# Altium schematic sheet Overview.SchDoc
size 431 x 279 mm; Date: Not shown in title block; ApprovedBy: Not shown in title block; CheckedBy: Not shown in title block; Author: Not shown in title block; CompanyName: Not shown in title block; Engineer: Not shown in title block; Organization: Not shown in title block; Address1: Not shown in title block; Address2: Not shown in title block; Address3: Not shown in title block; Address4: Not shown in title block; DocumentNumber: 1; Revision: Use project parameter SCH_Rev; SheetNumber: 2; SheetTotal: 3; PageSetup: Record=PageOptions|CenterHorizontal=True|CenterVertical=True|PrintScale=1.00|XCorrection=1.00|YCorrection=1.00|PrintKind=0|BorderSize=5000000|LeftOffset=0|BottomOffset=0|Orientation=2|PaperLength=1000|PaperWidth=1000|Scale=100|PaperSource=15|PrintQuality=600|MediaType=1|DitherType=10|PaperKind=Letter|PrintScaleMode=1; CurrentTime: Not shown in title block; CurrentDate: Not shown in title block; Time: Not shown in title block; DocumentFullPathAndName: Not shown in title block; DocumentName: Not shown in title block; ModifiedDate: Not shown in title block; ImagePath: Not shown in title block
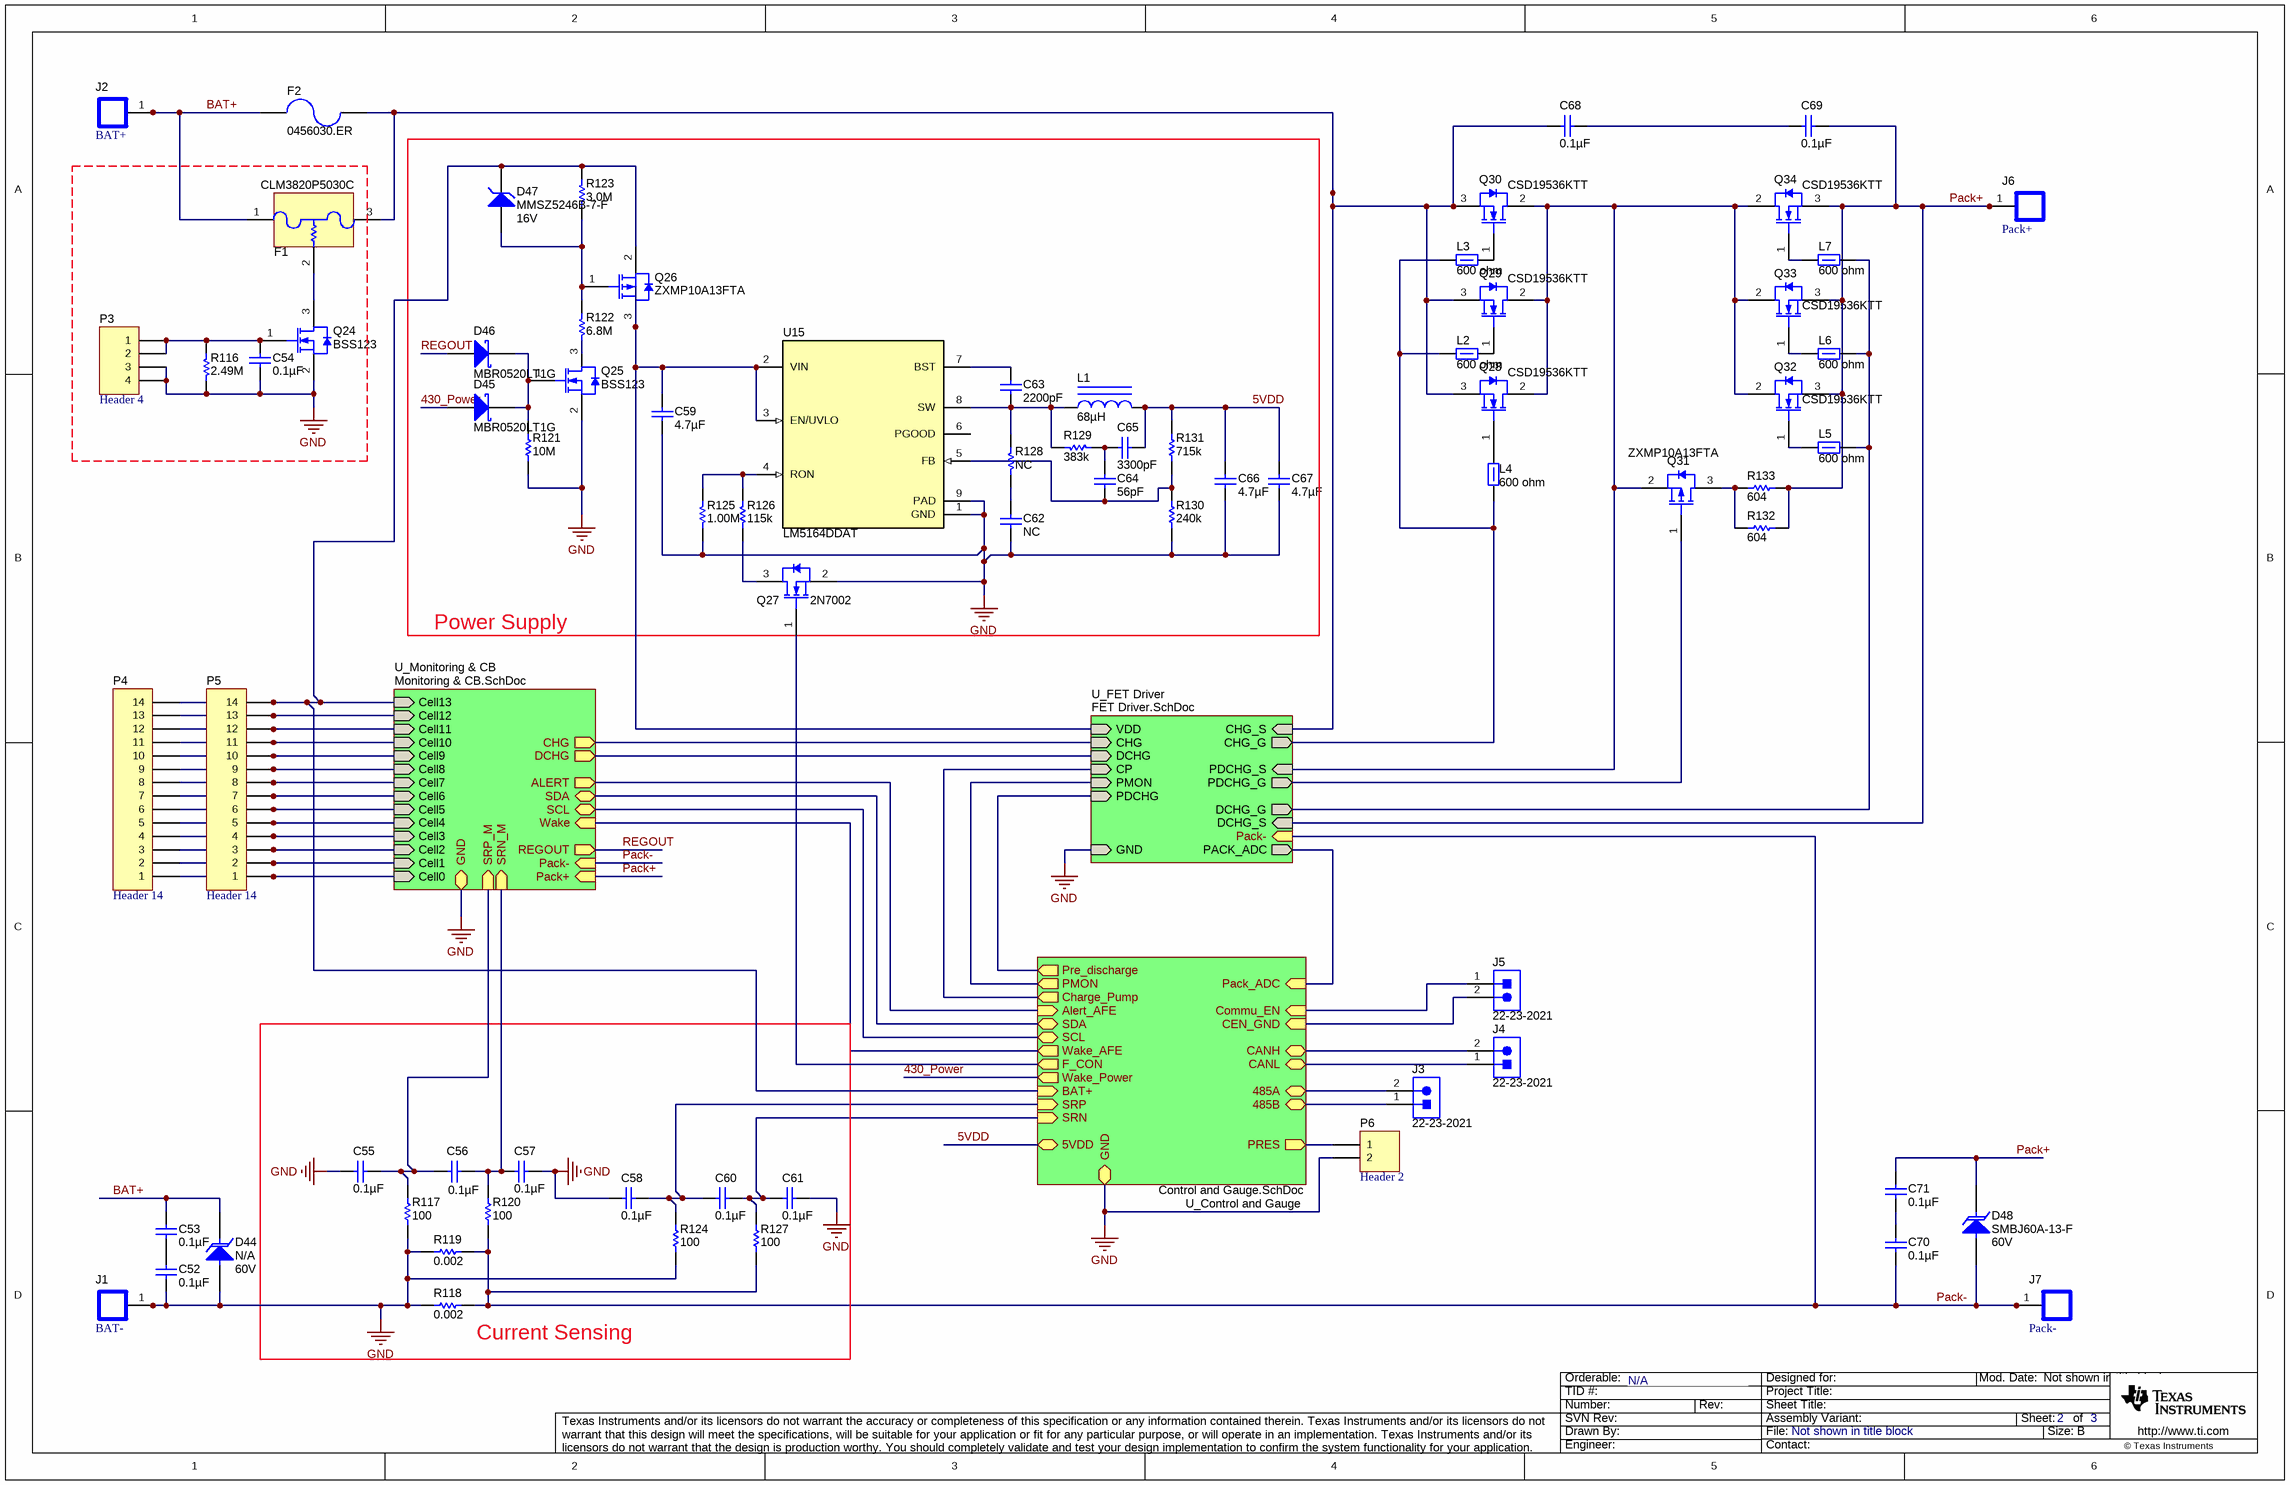
[diagram p0: Overview.SchDoc]

## Parts
C52  ValueDisplayed: 0.1µF  [0603]  (hidden comment: GRM188R72A104KA35D)
C53  ValueDisplayed: 0.1µF  [0603]  (hidden comment: GRM188R72A104KA35D)
C54  ValueDisplayed: 0.1µF  [0603]  (hidden comment: GRM188R71H104KA93D)
C55  ValueDisplayed: 0.1µF  [0603]  (hidden comment: GRM188R71H104KA93D)
C56  ValueDisplayed: 0.1µF  [0603]  (hidden comment: GRM188R71H104KA93D)
C57  ValueDisplayed: 0.1µF  [0603]  (hidden comment: GRM188R71H104KA93D)
C58  ValueDisplayed: 0.1µF  [0603]  (hidden comment: GRM188R71H104KA93D)
C59  ValueDisplayed: 4.7µF  [1210]  (hidden comment: C3225X7S2A475K200AE)
C60  ValueDisplayed: 0.1µF  [0603]  (hidden comment: GRM188R71H104KA93D)
C61  ValueDisplayed: 0.1µF  [0603]  (hidden comment: GRM188R71H104KA93D)
C62  GRM1885C1H560JA01D  [0603]  (value not drawn)
C63  ValueDisplayed: 2200pF  [0603]  (hidden comment: GRM1885C1H222JA01D)
C64  ValueDisplayed: 56pF  [0603]  (hidden comment: GRM1885C1H560JA01D)
C65  ValueDisplayed: 3300pF  [0603]  (hidden comment: GRM188R71H332KA01D)
C66  ValueDisplayed: 4.7µF  [0805_HV]  (hidden comment: GRM21BR71C475KA73L)
C67  ValueDisplayed: 4.7µF  [0805_HV]  (hidden comment: GRM21BR71C475KA73L)
C68  ValueDisplayed: 0.1µF  [0603]  (hidden comment: GRM188R72A104KA35D)
C69  ValueDisplayed: 0.1µF  [0603]  (hidden comment: GRM188R72A104KA35D)
C70  ValueDisplayed: 0.1µF  [0603]  (hidden comment: GRM188R72A104KA35D)
C71  ValueDisplayed: 0.1µF  [0603]  (hidden comment: GRM188R72A104KA35D)
D44  N/A  value 60V  [SMB]
D45  MBR0520LT1G  [SOD-123]
D46  MBR0520LT1G  [SOD-123]
D47  MMSZ5246B-7-F  value 16V  [SOD-123]
D48  SMBJ60A-13-F  value 60V  [SMB]
F1  CLM3820P5030C  [FUSE_SFK-xx30x]
F2  0456030.ER  [FUSE_0456030]
J1  BAT-  [SCREW_TERMINAL_8199]
J2  BAT+  [SCREW_TERMINAL_8199]
J3  22-23-2021  [Molex_22-23-2021]
J4  22-23-2021  [Molex_22-23-2021]
J5  22-23-2021  [Molex_22-23-2021]
J6  Pack+  [SCREW_TERMINAL_8199]
J7  Pack-  [SCREW_TERMINAL_8199]
L1  ValueDisplayed: 68µH  [WE-PD_1030]  (hidden comment: 7447713680)
L2  ValueDisplayed: 600 ohm  [0603]  (hidden comment: 74279265)
L3  ValueDisplayed: 600 ohm  [0603]  (hidden comment: 74279265)
L4  ValueDisplayed: 600 ohm  [0603]  (hidden comment: 74279265)
L5  ValueDisplayed: 600 ohm  [0603]  (hidden comment: 74279265)
L6  ValueDisplayed: 600 ohm  [0603]  (hidden comment: 74279265)
L7  ValueDisplayed: 600 ohm  [0603]  (hidden comment: 74279265)
P3  Header 4  [HDR1X4]
P4  Header 14  [HDR1X14]
P5  Header 14  [HDR1X14]
P6  Header 2  [HDR1X2]
Q24  BSS123  [SOT-23]
Q25  BSS123  [SOT-23]
Q26  ZXMP10A13FTA  [SOT-23]
Q27  2N7002  [SOT-23]
Q28  CSD19536KTT  [KTT0002A_N]
Q29  CSD19536KTT  [KTT0002A_N]
Q30  CSD19536KTT  [KTT0002A_N]
Q31  ZXMP10A13FTA  [SOT-23]
Q32  CSD19536KTT  [KTT0002A_N]
Q33  CSD19536KTT  [KTT0002A_N]
Q34  CSD19536KTT  [KTT0002A_N]
R116  ValueDisplayed: 2.49M  [0603]  (hidden comment: CRCW06032M49FKEA)
R117  ValueDisplayed: 100  [0603]  (hidden comment: CRCW0603100RFKEA)
R118  ValueDisplayed: 0.002  [2512]  (hidden comment: CSNL2512FT2L00)
R119  ValueDisplayed: 0.002  [2512]  (hidden comment: CSNL2512FT2L00)
R120  ValueDisplayed: 100  [0603]  (hidden comment: CRCW0603100RFKEA)
R121  ValueDisplayed: 10M  [0603]  (hidden comment: CRCW060310M0JNEA)
R122  ValueDisplayed: 6.8M  [0603]  (hidden comment: CRCW06036M80JNEA)
R123  ValueDisplayed: 3.0M  [0603]  (hidden comment: CRCW06033M00JNEA)
R124  ValueDisplayed: 100  [0603]  (hidden comment: CRCW0603100RFKEA)
R125  ValueDisplayed: 1.00M  [0603]  (hidden comment: CRCW06031M00FKEA)
R126  ValueDisplayed: 115k  [0603]  (hidden comment: CRCW0603115KFKEA)
R127  ValueDisplayed: 100  [0603]  (hidden comment: CRCW0603100RFKEA)
R128  RC0603FR-07383KL  [0603]  (value not drawn)
R129  ValueDisplayed: 383k  [0603]  (hidden comment: RC0603FR-07383KL)
R130  ValueDisplayed: 240k  [0603]  (hidden comment: CRCW0603240KJNEA)
R131  ValueDisplayed: 715k  [0603]  (hidden comment: CRCW0603715KFKEA)
R132  ValueDisplayed: 604  [2512]  (hidden comment: CRCW2512604RFKEG)
R133  ValueDisplayed: 604  [2512]  (hidden comment: CRCW2512604RFKEG)
U15  LM5164DDAT  [DDA0008E_N]

## Blocks framed on the sheet
Power Supply: C59 C62-C67 D45-D47 L1 Q25-Q27 R121-R123 R125 R126 R128-R131 U15
Current Sensing: C55-C58 C60 C61 R117-R120 R124 R127

## Sub-sheets
Designator = TID_Hardware.SchDoc: no entries
Designator = CoverSheet.SchDoc: no entries
U_Control and Gauge = Control and Gauge.SchDoc: SRP (in), SRN (in), BAT+ (in), Wake_Power (out), Wake_AFE (out), Alert_AFE (in), Pre_discharge (out), Charge_Pump (out), Pack_ADC (in), GND, CANH (bidir), 485B (bidir), CANL (bidir), 485A (bidir), PMON (out), SDA (bidir), SCL (bidir), Commu_EN (in), 5VDD, CEN_GND (in), PRES (out), F_CON (out)
U_FET Driver = FET Driver.SchDoc: DCHG_S (in), CHG_S (in), CHG_G (out), DCHG_G (out), PDCHG_G (out), CHG (in), CP (in), DCHG (in), PMON (in), PDCHG (in), PACK_ADC (out), VDD (in), GND (in), PDCHG_S (in), Pack- (in)
U_Monitoring & CB = Monitoring & CB.SchDoc: Cell0 (in), Cell1 (in), Cell2 (in), Cell3 (in), Cell4 (in), Cell5 (in), Cell6 (in), Cell7 (in), Cell8 (in), Cell9 (in), Cell10 (in), Cell11 (in), Cell12 (in), Cell13 (in), ALERT (out), CHG (out), DCHG (out), SDA (bidir), SCL (bidir), Pack+ (in), Pack- (in), Wake (in), REGOUT (out), GND, SRN_M (in), SRP_M (in)

## Nets
GND: C52.2 C54.2 C55.2 C57.1 C58.2 C59.2 C61.1 C62.2 C66.2 C67.2 D44.2(A) J1.1 J1.2 J1.3 J1.4 J1.5 J1.6 P3.3 P3.4 P6.2 Q24.2(S) Q25.2(S) Q27.2(S) R116.1 R117.1 R118.1 R119.1 R121.1 R124.1 R125.2 R130.1 U15.1(GND) U15.9(PAD) ; sheet U_Monitoring & CB/GND, sheet U_Control and Gauge/GND, sheet U_FET Driver/GND
5VDD: C65.2 C66.1 C67.1 L1.2 R131.2 ; sheet U_Control and Gauge/5VDD
430_Power: D45.2(A) ; sheet U_Control and Gauge/Wake_Power
BAT+: C53.1 D44.1(K) F1.1(Fuse) F2.2 J2.1 J2.2 J2.3 J2.4 J2.5 J2.6
Pack+: C69.1 C71.1 D48.1(K) J6.1 J6.2 J6.3 J6.4 J6.5 J6.6 Q32.3(S) Q33.3(S) Q34.3(S) R132.1 R133.1 ; sheet U_Monitoring & CB/Pack+, sheet U_FET Driver/DCHG_S
Pack-: C70.2 D48.2(A) J7.1 J7.2 J7.3 J7.4 J7.5 J7.6 R118.2 R119.2 R120.1 R127.1 ; sheet U_Monitoring & CB/Pack-, sheet U_FET Driver/Pack-
REGOUT: D46.2(A) ; sheet U_Monitoring & CB/REGOUT
NetC52_1: C52.1 C53.2
NetC54_1: C54.1 P3.1 P3.2 Q24.1(G) R116.2
NetC55_1: C55.1 C56.2 R117.2 ; sheet U_Monitoring & CB/SRP_M
NetC56_1: C56.1 C57.2 R120.2 ; sheet U_Monitoring & CB/SRN_M
NetC58_1: C58.1 C60.2 R124.2 ; sheet U_Control and Gauge/SRP
NetC59_1: C59.1 Q26.3(D) U15.2(VIN) U15.3(EN/UVLO) ; sheet U_FET Driver/VDD
NetC60_1: C60.1 C61.2 R127.2 ; sheet U_Control and Gauge/SRN
NetC62_1: C62.1 R128.1
NetC63_1: C63.1 U15.7(BST)
NetC63_2: C63.2 L1.1 R128.2 R129.1 U15.8(SW)
NetC64_1: C64.1 C65.1 R129.2
NetC64_2: C64.2 R130.2 R131.1 U15.5(FB)
NetC68_1: C68.1 C69.2
NetC68_2: C68.2 F1.3(Fuse) F2.1 Q28.3(S) Q29.3(S) Q30.3(S) ; sheet U_FET Driver/CHG_S
NetC70_1: C70.1 C71.2
NetD45_1: D45.1(K) D46.1(K) Q25.1(G) R121.2
NetD47_1: D47.1(K) P4.14 P5.14 Q26.2(S) R123.2 ; sheet U_Monitoring & CB/Cell13, sheet U_Control and Gauge/BAT+
NetD47_2: D47.2(A) Q26.1(G) R122.2 R123.1
NetF1_2: F1.2(Heater) Q24.3(D)
NetJ3_1: J3.1 ; sheet U_Control and Gauge/485B
NetJ3_2: J3.2 ; sheet U_Control and Gauge/485A
NetJ4_1: J4.1 ; sheet U_Control and Gauge/CANL
NetJ4_2: J4.2 ; sheet U_Control and Gauge/CANH
NetJ5_1: J5.1 ; sheet U_Control and Gauge/Commu_EN
NetJ5_2: J5.2 ; sheet U_Control and Gauge/CEN_GND
NetL2_1: L2.1 L3.1 L4.1 ; sheet U_FET Driver/CHG_G
NetL2_2: L2.2 Q29.1(G)
NetL3_2: L3.2 Q30.1(G)
NetL4_2: L4.2 Q28.1(G)
NetL5_1: L5.1 Q32.1(G)
NetL5_2: L5.2 L6.2 L7.2 ; sheet U_FET Driver/DCHG_G
NetL6_1: L6.1 Q33.1(G)
NetL7_1: L7.1 Q34.1(G)
NetP4_1: P4.1 P5.1 ; sheet U_Monitoring & CB/Cell0
NetP4_2: P4.2 P5.2 ; sheet U_Monitoring & CB/Cell1
NetP4_3: P4.3 P5.3 ; sheet U_Monitoring & CB/Cell2
NetP4_4: P4.4 P5.4 ; sheet U_Monitoring & CB/Cell3
NetP4_5: P4.5 P5.5 ; sheet U_Monitoring & CB/Cell4
NetP4_6: P4.6 P5.6 ; sheet U_Monitoring & CB/Cell5
NetP4_7: P4.7 P5.7 ; sheet U_Monitoring & CB/Cell6
NetP4_8: P4.8 P5.8 ; sheet U_Monitoring & CB/Cell7
NetP4_9: P4.9 P5.9 ; sheet U_Monitoring & CB/Cell8
NetP4_10: P4.10 P5.10 ; sheet U_Monitoring & CB/Cell9
NetP4_11: P4.11 P5.11 ; sheet U_Monitoring & CB/Cell10
NetP4_12: P4.12 P5.12 ; sheet U_Monitoring & CB/Cell11
NetP4_13: P4.13 P5.13 ; sheet U_Monitoring & CB/Cell12
NetP6_1: P6.1 ; sheet U_Control and Gauge/PRES
NetQ25_3: Q25.3(D) R122.1
NetQ27_1: Q27.1(G) ; sheet U_Control and Gauge/F_CON
NetQ27_3: Q27.3(D) R126.2
NetQ28_2: Q28.2(D) Q29.2(D) Q30.2(D) Q31.2(S) Q32.2(D) Q33.2(D) Q34.2(D) ; sheet U_FET Driver/PDCHG_S
NetQ31_1: Q31.1(G) ; sheet U_FET Driver/PDCHG_G
NetQ31_3: Q31.3(D) R132.2 R133.2
NetR125_1: R125.1 R126.1 U15.4(RON)
(unnamed): sheet U_Monitoring & CB/ALERT, sheet U_Control and Gauge/Alert_AFE
(unnamed): sheet U_Monitoring & CB/CHG, sheet U_FET Driver/CHG
(unnamed): sheet U_Monitoring & CB/DCHG, sheet U_FET Driver/DCHG
(unnamed): sheet U_Monitoring & CB/SDA, sheet U_Control and Gauge/SDA
(unnamed): sheet U_Monitoring & CB/SCL, sheet U_Control and Gauge/SCL
(unnamed): sheet U_Monitoring & CB/Wake, sheet U_Control and Gauge/Wake_AFE
(unnamed): sheet U_Control and Gauge/Pre_discharge, sheet U_FET Driver/PDCHG
(unnamed): sheet U_Control and Gauge/Charge_Pump, sheet U_FET Driver/CP
(unnamed): sheet U_Control and Gauge/Pack_ADC, sheet U_FET Driver/PACK_ADC
(unnamed): sheet U_Control and Gauge/PMON, sheet U_FET Driver/PMON

Not connected (* = marked no-connect by the designer): U15 6(PGOOD)

## Notes on the sheet
- N/A
- Drawn By:
- SVN Rev:
- Number:
- TID #:
- Orderable:
- Rev:
- Sheet Title:
- File:
- Project Title:
- Designed for:
- Assembly Variant:
- Mod. Date:
- Sheet:
- Size:
- of
- B
- http://www.ti.com
- Texas Instruments and/or its licensors do not warrant the accuracy or completeness of this specification or any information contained therein. Texas Instruments and/or its licensors do not warrant that this design will meet the specifications, will be suitable for your application or fit for any particular purpose, or will operate in an implementation. Texas Instruments and/or its licensors do not warrant that the design is production worthy. You should completely validate and test your design implementation to confirm the system functionality for your application.
- Engineer:
- Contact:
- © Texas Instruments

## Library data of the parts
C52 C53 C68-C71 = GRM188R72A104KA35D: CAP, CERM, 0.1 µF, 100 V,+/- 10%, X7R, 0603; Manufacturer: MuRata; Polarized: N; CompType: Capacitor; Value: 0.1uF; U/M: EA; Cap_F: 0.0000001; Tolerance_%: 10; VDC_V: 100; Value2: 100V; TaMin_C: -55; TaMax_C: 125; SizeArea_mm2: 1.28; SizeAreaWB_mm2: 4.68; SizeX_mm: 1.6; SizeY_mm: 0.8; SizeZ_mm: 1; AEC Category: Q200; Green_Lifecycle: Active; Green_REACh: Passed; SymbolVersion: 2008-07-09; PartNumber: GRM188R72A104KA35D; PackageReference: 0603; RoHS: Y; MountType: SMT; Technology: Ceramic; TempCo: X7R; Cap_Case: 0603; Published: 2008-06-19; Publisher: Texas Instruments; LatestRevisionDate: 2017-06-22; ComponentLink1Description: Datasheet link; ComponentLink1URL: http://search.murata.co.jp/Ceramy/PnsearchViewAction.do?HnOFG=ON&HnNFG=ON&SEL_CNT=50&sLang=en&sKey=GRM188R72A104KA35D&x=9&y=9&search=startwith; Supplier 1: Digi-Key; Supplier Part Number 1: 490-3285-1-ND; Supplier 2: Mouser; Supplier Part Number 2: 81-GRM188R72A104KA35; Supplier 3: Farnell; Supplier Part Number 3: 1828921; AEC Qualified: ?; Green_EU RoHS: Passed; Green_EU RoHS-2: Passed
C54-C58 C60 C61 = GRM188R71H104KA93D: CAP, CERM, 0.1 µF, 50 V,+/- 10%, X7R, 0603; Manufacturer: MuRata; Polarized: N; CompType: Capacitor; Value: 0.1uF; U/M: EA; Cap_F: 0.0000001; Tolerance_%: 10; VDC_V: 50; Value2: 50V; TaMin_C: -55; TaMax_C: 125; SizeArea_mm2: 1.28; SizeAreaWB_mm2: 4.68; SizeX_mm: 1.6; SizeY_mm: 0.8; SizeZ_mm: 1; AEC Category: Q200; Green_Lifecycle: Active; Green_REACh: Passed; SymbolVersion: 2008-07-09; PartNumber: GRM188R71H104KA93D; PackageReference: 0603; RoHS: Y; MountType: SMT; Technology: Ceramic; TempCo: X7R; Cap_Case: 0603; Published: 2008-06-19; Publisher: Texas Instruments; LatestRevisionDate: 2017-06-22; ComponentLink1Description: Datasheet link; ComponentLink1URL: http://search.murata.co.jp/Ceramy/PnsearchViewAction.do?HnOFG=ON&HnNFG=ON&SEL_CNT=50&sLang=en&sKey=GRM188R71H104KA93D&x=9&y=9&search=startwith; Supplier 1: Digi-Key; Supplier Part Number 1: 490-1519-1-ND; Supplier 2: Mouser; Supplier Part Number 2: 81-GRM39X104K50D; Supplier 3: Farnell; Supplier Part Number 3: 8820023; AEC Qualified: ?; Green_EU RoHS: Passed; Green_EU RoHS-2: Incomplete
C59 = C3225X7S2A475K200AE: CAP, CERM, 4.7 µF, 100 V,+/- 10%, X7S, 1210; Manufacturer: TDK; Polarized: N; CompType: Capacitor; Value: 4.7uF; U/M: EA; Cap_F: 0.0000047; Tolerance_%: 10; VDC_V: 100; Value2: 100V; TaMin_C: -55; TaMax_C: 125; SizeArea_mm2: 8; SizeAreaWB_mm2: 14.7; SizeX_mm: 3.2; SizeY_mm: 2.5; SizeZ_mm: 1.35; AEC Category: Q200; Green_Lifecycle: Active; Green_REACh: Passed; SymbolVersion: 2008-07-09; PartNumber: C3225X7S2A475K200AE; PackageReference: 1210; RoHS: Y; MountType: SMT; Technology: Ceramic; TempCo: X7S; Cap_Case: 1210; Published: 2008-06-19; Publisher: Texas Instruments; LatestRevisionDate: 2017-06-22; ComponentLink1Description: Datasheet link; ComponentLink1URL: https://product.tdk.com/info/en/catalog/datasheets/mlcc_commercial_midvoltage_en.pdf; Supplier 1: Digi-Key; Supplier Part Number 1: 445-8912-1-ND; Supplier 2: Newark; Supplier Part Number 2: 93T4954; Supplier 3: Mouser; Supplier Part Number 3: 810-C3225X7S2A475KST; AEC Qualified: N; AEC Grade: N/A; Green_EU RoHS: Passed; Green_EU RoHS-2: Passed
C62 = GRM1885C1H560JA01D: NC; Manufacturer: MuRata; Polarized: N; CompType: Capacitor; Value: 56pF; U/M: EA; Cap_F: 0.000000000056; Tolerance_%: 5; VDC_V: 50; Value2: 50V; TempCo: C0G/NP0; TaMin_C: -55; TaMax_C: 125; SizeArea_mm2: 1.28; SizeAreaWB_mm2: 4.68; SizeX_mm: 1.6; SizeY_mm: 0.8; SizeZ_mm: 1; AEC Category: Q200; Green_Lifecycle: Active; Green_REACh: Passed; SymbolVersion: 2008-07-09; PartNumber: GRM1885C1H560JA01D; ValueDisplayed: NC; PackageReference: 0603; RoHS: Y; MountType: SMT; Technology: Ceramic; Cap_Case: 0603; Published: 2008-06-19; Publisher: Texas Instruments; LatestRevisionDate: 2017-06-22; ComponentLink1Description: Datasheet link; ComponentLink1URL: http://search.murata.co.jp/Ceramy/PnsearchViewAction.do?HnOFG=ON&HnNFG=ON&SEL_CNT=50&sLang=en&sKey=GRM1885C1H560JA01D&x=9&y=9&search=startwith; Supplier 1: Digi-Key; Supplier Part Number 1: 490-1421-1-ND; Supplier 2: Mouser; Supplier Part Number 2: 81-GRM39C560J50; Supplier 3: Farnell; Supplier Part Number 3: 1828911; AEC Qualified: ?; Green_EU RoHS: Passed; Green_EU RoHS-2: Incomplete
C63 = GRM1885C1H222JA01D: CAP, CERM, 2200 pF, 50 V,+/- 5%, C0G/NP0, 0603; Manufacturer: MuRata; Polarized: N; CompType: Capacitor; Value: 2200pF; U/M: EA; Cap_F: 0.0000000022; Tolerance_%: 5; VDC_V: 50; Value2: 50V; TaMin_C: -55; TaMax_C: 125; SizeArea_mm2: 1.28; SizeAreaWB_mm2: 4.68; SizeX_mm: 1.6; SizeY_mm: 0.8; SizeZ_mm: 1; AEC Category: Q200; Green_Lifecycle: Active; Green_REACh: Passed; SymbolVersion: 2008-07-09; PartNumber: GRM1885C1H222JA01D; PackageReference: 0603; RoHS: Y; MountType: SMT; Technology: Ceramic; TempCo: C0G/NP0; Cap_Case: 0603; Published: 2008-06-19; Publisher: Texas Instruments; LatestRevisionDate: 2017-06-22; ComponentLink1Description: Datasheet link; ComponentLink1URL: http://search.murata.co.jp/Ceramy/PnsearchViewAction.do?HnOFG=ON&HnNFG=ON&SEL_CNT=50&sLang=en&sKey=GRM1885C1H222JA01D&x=9&y=9&search=startwith; Supplier 1: Digi-Key; Supplier Part Number 1: 490-1459-1-ND; Supplier 2: Mouser; Supplier Part Number 2: 81-GRM1885C1H222JA01; Supplier 3: Farnell; Supplier Part Number 3: 8819947; AEC Qualified: ?; Green_EU RoHS: Passed; Green_EU RoHS-2: Passed
C64 = GRM1885C1H560JA01D: CAP, CERM, 56 pF, 50 V,+/- 5%, C0G/NP0, 0603; Manufacturer: MuRata; Polarized: N; CompType: Capacitor; Value: 56pF; U/M: EA; Cap_F: 0.000000000056; Tolerance_%: 5; VDC_V: 50; Value2: 50V; TaMin_C: -55; TaMax_C: 125; SizeArea_mm2: 1.28; SizeAreaWB_mm2: 4.68; SizeX_mm: 1.6; SizeY_mm: 0.8; SizeZ_mm: 1; AEC Category: Q200; Green_Lifecycle: Active; Green_REACh: Passed; SymbolVersion: 2008-07-09; PartNumber: GRM1885C1H560JA01D; PackageReference: 0603; RoHS: Y; MountType: SMT; Technology: Ceramic; TempCo: C0G/NP0; Cap_Case: 0603; Published: 2008-06-19; Publisher: Texas Instruments; LatestRevisionDate: 2017-06-22; ComponentLink1Description: Datasheet link; ComponentLink1URL: http://search.murata.co.jp/Ceramy/PnsearchViewAction.do?HnOFG=ON&HnNFG=ON&SEL_CNT=50&sLang=en&sKey=GRM1885C1H560JA01D&x=9&y=9&search=startwith; Supplier 1: Digi-Key; Supplier Part Number 1: 490-1421-1-ND; Supplier 2: Mouser; Supplier Part Number 2: 81-GRM39C560J50; Supplier 3: Farnell; Supplier Part Number 3: 1828911; AEC Qualified: ?; Green_EU RoHS: Passed; Green_EU RoHS-2: Incomplete
C65 = GRM188R71H332KA01D: CAP, CERM, 3300 pF, 50 V,+/- 10%, X7R, 0603; Manufacturer: MuRata; Polarized: N; CompType: Capacitor; Value: 3300pF; U/M: EA; Cap_F: 0.0000000033; Tolerance_%: 10; VDC_V: 50; Value2: 50V; TaMin_C: -55; TaMax_C: 125; SizeArea_mm2: 1.28; SizeAreaWB_mm2: 4.68; SizeX_mm: 1.6; SizeY_mm: 0.8; SizeZ_mm: 1; AEC Category: Q200; Green_Lifecycle: Active; Green_REACh: Passed; SymbolVersion: 2008-07-09; PartNumber: GRM188R71H332KA01D; PackageReference: 0603; RoHS: Y; MountType: SMT; Technology: Ceramic; TempCo: X7R; Cap_Case: 0603; Published: 2008-06-19; Publisher: Texas Instruments; LatestRevisionDate: 2017-06-22; ComponentLink1Description: Datasheet link; ComponentLink1URL: http://search.murata.co.jp/Ceramy/PnsearchViewAction.do?HnOFG=ON&HnNFG=ON&SEL_CNT=50&sLang=en&sKey=GRM188R71H332KA01D&x=9&y=9&search=startwith; Supplier 1: Digi-Key; Supplier Part Number 1: 490-1503-1-ND; Supplier 2: Mouser; Supplier Part Number 2: 81-GRM188R71H332KA; Supplier 3: Farnell; Supplier Part Number 3: 1828914; AEC Qualified: ?; Green_EU RoHS: Passed; Green_EU RoHS-2: Incomplete
C66 C67 = GRM21BR71C475KA73L: CAP, CERM, 4.7 µF, 16 V,+/- 10%, X7R, 0805; Manufacturer: MuRata; Polarized: N; CompType: Capacitor; Value: 4.7uF; U/M: EA; Cap_F: 0.0000047; Tolerance_%: 10; ESR_ohm: 0.006; Value1: 0.006 ohm; VDC_V: 16; Value2: 16V; TaMin_C: -55; TaMax_C: 125; Cap_Case: 0805; SizeArea_mm2: 2.5; SizeAreaWB_mm2: 6.75; SizeX_mm: 2; SizeY_mm: 1.25; SizeZ_mm: 1.45; AEC Category: Q200; Green_Lifecycle: Active; Green_REACh: Passed; SymbolVersion: 2008-07-09; PartNumber: GRM21BR71C475KA73L; PackageReference: 0805; RoHS: Y; MountType: SMT; Technology: Ceramic; TempCo: X7R; Published: 2008-06-19; Publisher: Texas Instruments; LatestRevisionDate: 2017-06-22; ComponentLink1Description: Datasheet link; ComponentLink1URL: http://search.murata.co.jp/Ceramy/PnsearchViewAction.do?HnOFG=ON&HnNFG=ON&SEL_CNT=50&sLang=en&sKey=GRM21BR71C475KA73L&x=9&y=9&search=startwith; Supplier 1: Digi-Key; Supplier Part Number 1: 490-4522-1-ND; Supplier 2: Mouser; Supplier Part Number 2: 81-GRM21BR71C475KA73; Supplier 3: Farnell; Supplier Part Number 3: 1797015; AEC Qualified: ?; Green_EU RoHS: Passed; Green_EU RoHS-2: Incomplete
D44 D48 = SMBJ60A-13-F: Diode, TVS, Uni, 60 V, 96.8 Vc, SMB; Manufacturer: Diodes Inc.; U/M: EA; Power_W: 5; Vr_V: 60; Value1: 5W; SizeAreaWB_mm2: 44.156; SizeArea_mm2: 21.336; SizeX_mm: 5.6; SizeY_mm: 3.81; SizeZ_mm: 2.6; AEC Category: Q101; CompType: TVS; SymbolVersion: 2012-01-13; PartNumber: SMBJ60A-13-F; PackageReference: SMB; Vz_V: N/A; MountType: SMT; RoHS: Y; ComponentLink1Description: Datasheet link; ComponentLink1URL: http://www.diodes.com/datasheets/ds19002.pdf; Published: 2008-10-08; Publisher: Texas Instruments; LatestRevisionDate: 2017-06-20; LatestRevisionNote: Updated Supplier Data; Supplier 1: Digi-Key; Supplier Part Number 1: SMBJ60A-FDICT-ND; Supplier 2: Mouser; Supplier Part Number 2: 621-SMBJ60A-13-F; AEC Qualified: ?
D45 D46 = MBR0520LT1G: Diode, Schottky, 20 V, 0.5 A, SOD-123; Manufacturer: ON Semiconductor; U/M: EA; Vf_V: 0.385; Value: 20V; Value1: 0.5A; Value2: 0.385V; Io_A: 0.5; Vr_V: 20; TJmax_C: 125; RJC_CperW: 150; SizeAreaWB_mm2: 13.095; SizeArea_mm2: 6.545; SizeX_mm: 3.85; SizeY_mm: 1.7; SizeZ_mm: 1.35; AEC Category: Q101; Green_Lifecycle: Active; Green_REACh: Passed; CompType: Diode; SymbolVersion: 2008-12-08; PartNumber: MBR0520LT1G; PackageReference: SOD-123; MountType: SMT; Type: Schottky; RoHS: Y; Published: 2008-06-26; Publisher: Texas Instruments; LatestRevisionDate: 2017-06-26; ComponentLink1Description: Datasheet link; ComponentLink1URL: http://www.onsemi.com/pub_link/Collateral/MBR0520LT1-D.PDF; Supplier 1: Digi-Key; Supplier Part Number 1: MBR0520LT1GOSCT-ND; Supplier 2: Newark; Supplier Part Number 2: 48K7498; Supplier 3: Mouser; Supplier Part Number 3: 863-MBR0520LT1G; AEC Qualified: ?; Green_EU RoHS: Passed; Green_EU RoHS-2: Passed
D47 = MMSZ5246B-7-F: Diode, Zener, 16 V, 500 mW, SOD-123; Manufacturer: Diodes Inc.; SymbolCreator: a0412235; U/M: EA; Power_W: 0.5; Vz_V: 16; Value1: 0.5W; RJA_CperW: 350; SizeAreaWB_mm2: 13.095; SizeArea_mm2: 6.545; SizeX_mm: 3.85; SizeY_mm: 1.7; SizeZ_mm: 1.35; AEC Category: Q101; Green_Lifecycle: Active; Green_REACh: Passed; SymbolVersion: 2010-08-25; PartNumber: MMSZ5246B-7-F; PackageReference: SOD-123; CompType: Zener; Vr_V: N/A; MountType: SMT; RoHS: Y; ComponentLink1Description: Datasheet link; ComponentLink1URL: http://www.diodes.com/datasheets/ds18010.pdf; Published: 2008-10-08; Publisher: Texas Instruments; LatestRevisionDate: 2017-06-20; LatestRevisionNote: Updated Supplier Data; Supplier 1: Digi-Key; Supplier Part Number 1: MMSZ5246B-FDICT-ND; Supplier 2: Mouser; Supplier Part Number 2: 621-MMSZ5246B-F; Supplier 3: Farnell; Supplier Part Number 3: 2061482; AEC Qualified: ?; Green_EU RoHS: Passed; Green_EU RoHS-2: Passed
F1 = SFK-5030: Fuse, 30 A, SMD; Manufacturer: POLYTRONICS; SymbolCreator: x0208325; VDC_V: 62; Irating_A: 30; Rtyp_Ohm: 0.0015; SymbolVersion: 2013-11-4; PartNumber: CLM3820P5030C; PackageReference: 9.5x2x5mm; MountType: SMT; CompType: Fuse; RoHS: Y; Published: 2009-03-05; Publisher: Texas Instruments; LatestRevisionDate: 2017-05-15; ComponentLink1Description: Datasheet URL
F2 = 0456030.ER: Fuse, 30 A, 125 VAC, 72 VDC, SMD; Manufacturer: Littelfuse; VDC_V: 72; VAC_V: 125; Irating_A: 30; Rtyp_Ohm: 0.00132; MeltingTyp: 81; SymbolVersion: 2008-07-09; PartNumber: 0456030.ER; PackageReference: 10.1x3.12mm; MountType: SMT; CompType: Fuse; RoHS: Y; Published: 2009-03-05; Publisher: Texas Instruments; LatestRevisionDate: 2017-05-15; ComponentLink1Description: Datasheet URL; ComponentLink1URL: http://www.littelfuse.com/~/media/electronics/datasheets/fuses/littelfuse_fuse_456_datasheet.pdf.pdf; Supplier 1: Digi-Key; Supplier Part Number 1: F3345CT-ND; Supplier 2: Newark; Supplier Part Number 2: 01P9331; Supplier 3: Mouser; Supplier Part Number 3: 576-0456030.ER
J1 J2 J6 J7 = 8199: TERMINAL SCREW PC 30AMP, TH; Manufacturer: Keystone; SymbolCreator: a0799628; CompType: Screw Connector; Green_Lifecycle: Active; Green_REACh: Passed; SymbolVersion: 2013-08-13; PartNumber: 8199; PackageReference: 12.9x6.3x7.9 mm; RoHS: Y; MountType: TH; ComponentLink1Description: Datasheet URL; ComponentLink1URL: http://www.keyelco.com/userAssets/file/M60-2p63.pdf; Publisher: Texas Instruments; LatestRevisionDate: 2017-05-11; Supplier 1: Digi-Key; Supplier Part Number 1: 36-8199-ND; Supplier 2: Newark; Supplier Part Number 2: 62W5246; Supplier 3: Mouser; Supplier Part Number 3: 534-8199; Green_EU RoHS: Passed; Green_EU RoHS-2: Incomplete
J3-J5 = 22-23-2021: Header, 2.54mm, 2x1, Vertical, TH; Manufacturer: Molex; SymbolCreator: a0412235; Green_Lifecycle: Active; Green_REACh: Passed; SymbolVersion: 2013-10-31; PartNumber: 22-23-2021; PackageReference: Header, 2.54mm, 2x1, TH; CompType: Header; RoHS: Y; MountType: TH; ComponentLink1Description: Datasheet URL; ComponentLink1URL: http://www.molex.com/pdm_docs/sd/022232021_sd.pdf; Publisher: Texas Instruments; LatestRevisionDate: 2017-06-22; Supplier 1: Digi-Key; Supplier Part Number 1: WM4200-ND; Supplier 2: Newark; Supplier Part Number 2: 25C3832; Supplier 3: Mouser; Supplier Part Number 3: 538-22-23-2021; Green_EU RoHS: Passed; Green_EU RoHS-2: Passed
L1 = 7447713680: Inductor, Shielded Drum Core, Ferrite, 68 µH, 1.1 A, 0.275 ohm, SMD; Manufacturer: Wurth Elektronik; Value: 68uH; Ind_H: 68.0E-6; Imax_A: 1.1; Irms: 1.1A @ 40C rise; Isat: 1.6A @ 10% inductance drop; DCR_ohm: 0.275; Value2: 1.1A; SizeAreaWB_mm2: 144; SizeArea_mm2: 100; SizeX_mm: 10; SizeZ_mm: 3; AEC Category: Q200; Green_Lifecycle: Active; Green_REACh: Passed; SymbolVersion: 2008-07-23; CompType: Inductor; PartNumber: 7447713680; Value1: 0.275 ohm; Technology: Shielded Drum Core; MountType: SMT; Material: Ferrite; PackageReference: SMD; Published: 2008-06-26; Publisher: Texas Instruments; LatestRevisionDate: 2017-06-26; ComponentLink1Description: Datasheet link; ComponentLink1URL: http://katalog.we-online.de/kataloge/eisos/media/pdf/7447713680.pdf; RoHS: Y; SizeY_mm: 10; Supplier 1: Digi-Key; Supplier Part Number 1: 732-2983-1-ND; AEC Qualified: ?; Green_EU RoHS: Passed; Green_EU RoHS-2: Incomplete
L2-L7 = 74279265: Ferrite Bead, 600 ohm @ 100 MHz, 0.2 A, 0603; Manufacturer: Wurth Elektronik; Value: 600 ohm; Imax_A: 0.2; DCR_ohm: 0.45; Value1: 0.45 ohm; Value2: 0.2A; SizeAreaWB_mm2: 4.68; SizeArea_mm2: 1.28; SizeX_mm: 1.6; SizeY_mm: 0.8; SizeZ_mm: 1; ZTyp@100MHz_Ohm: 600; Ztyp@1GHz_Ohm: 223.805; Green_Lifecycle: Active; Green_REACh: Passed; SymbolVersion: 2017-01-06; PartNumber: 74279265; CompType: Ferrite Bead; MountType: SMT; PackageReference: 0603; Published: 2014-04-30; Publisher: Texas Instruments; LatestRevisionDate: 2017-06-22; ComponentLink1Description: Datasheet link; ComponentLink1URL: http://katalog.we-online.de/pbs/datasheet/74279265.pdf; RoHS: Y; Supplier 1: Digi-Key; Supplier Part Number 1: 732-1583-1-ND; Supplier 2: Mouser; Supplier Part Number 2: 710-74279265; Green_EU RoHS: Passed; Green_EU RoHS-2: Incomplete
P3 = Header 4: Header, 4-Pin; LatestRevisionDate: 17-Jul-2002; LatestRevisionNote: Re-released for DXP Platform.; Publisher: Altium Limited
P4 P5 = Header 14: Header, 14-Pin; LatestRevisionDate: 17-Jul-2002; LatestRevisionNote: Re-released for DXP Platform.; Publisher: Altium Limited
P6 = Header 2: Header, 2-Pin; LatestRevisionDate: 17-Jul-2002; LatestRevisionNote: Re-released for DXP Platform.; Publisher: Altium Limited
Q24 Q25 = BSS123: MOSFET, N-CH, 100 V, 0.17 A, SOT-23; Manufacturer: Fairchild Semiconductor; Alternate Manufacturer: None; U/M: EA; ChType: N; Value: 100V; VdsMax_V: 100; Value1: 10 ohm; Rdson45_ohm: 10; Value2: 1.8 nC; QgTyp_nC: 1.8; Vgs_V: 20; IdsMax_A: 0.17; SizeAreaWB_mm2: 14; SizeArea_mm2: 7.5; SizeX_mm: 2.5; SizeY_mm: 3; SizeZ_mm: 1.1; AEC Category: Q101; Green_Lifecycle: Active; Green_REACh: Passed; SymbolVersion: 2008-07-28; CompType: MOSFET; PartNumber: BSS123; PackageReference: SOT-23; RoHS: Y; MountType: SMT; Published: 2008-06-19; Publisher: Texas Instruments; LatestRevisionDate: 2017-06-26; LatestRevisionNote: Added parts.; ComponentLink1Description: Datasheet link; ComponentLink1URL: http://www.fairchildsemi.com/ds/BS/BSS123.pdf; Supplier 1: Digi-Key; Supplier Part Number 1: BSS123NCT-ND; Supplier 2: Newark; Supplier Part Number 2: 58K8768; Supplier 3: Mouser; Supplier Part Number 3: 512-BSS123; AEC Qualified: ?; Green_EU RoHS: Passed; Green_EU RoHS-2: Passed
Q26 Q31 = ZXMP10A13FTA: MOSFET, P-CH, -100 V, -0.6 A, SOT-23; Manufacturer: Diodes Inc.; Alternate Manufacturer: None; U/M: EA; ChType: P; Value: -100V; Value1: 1 ohm; Rdson45_ohm: 1; Value2: 3.5 nC; QgTyp_nC: 3.5; Vgs_V: -4; SizeAreaWB_mm2: 14; SizeArea_mm2: 7.5; SizeX_mm: 2.5; SizeY_mm: 3; SizeZ_mm: 1.1; AEC Category: Q101; Green_Lifecycle: Active; Green_REACh: Passed; SymbolVersion: 2008-07-09; PartNumber: ZXMP10A13FTA; PackageReference: SOT-23; CompType: MOSFET; VdsMax_V: -100; IdsMax_A: -0.6; RoHS: Y; MountType: SMT; Published: 2008-06-19; Publisher: Texas Instruments; LatestRevisionDate: 2017-06-26; LatestRevisionNote: Added parts.; ComponentLink1Description: Datasheet link; ComponentLink1URL: http://www.diodes.com/datasheets/ZXMP10A13F.pdf; Supplier 1: Digi-Key; Supplier Part Number 1: ZXMP10A13FCT-ND; Supplier 2: Newark; Supplier Part Number 2: 12T2274; Supplier 3: Mouser; Supplier Part Number 3: 522-ZXMP10A13FTA; AEC Qualified: ?; Green_EU RoHS: Passed; Green_EU RoHS-2: Passed
Q27 = 2N7002: MOSFET, N-CH, 60 V, 115 A, SOT-23; Manufacturer: Fairchild Semiconductor; Alternate Manufacturer: None; U/M: EA; ChType: N; Value: 60V; VdsMax_V: 60; Value1: ? ohm; Value2: ? nC; Vgs_V: 20; IdsMax_A: 115; SizeAreaWB_mm2: 14; SizeArea_mm2: 7.5; SizeX_mm: 2.5; SizeY_mm: 3; SizeZ_mm: 1.1; AEC Category: Q101; Green_Lifecycle: Active; Green_REACh: Passed; SymbolVersion: 2008-07-28; CompType: MOSFET; PartNumber: 2N7002; PackageReference: SOT-23; RoHS: Y; MountType: SMT; Published: 2008-06-19; Publisher: Texas Instruments; LatestRevisionDate: 2017-06-26; LatestRevisionNote: Added parts.; ComponentLink1Description: Datasheet link; ComponentLink1URL: https://www.fairchildsemi.com/datasheets/2N/2N7000.pdf; Supplier 1: Digi-Key; Supplier Part Number 1: 2N7002NCT-ND; Supplier 2: Newark; Supplier Part Number 2: 58K9651; Supplier 3: Mouser; Supplier Part Number 3: 512-2N7002; AEC Qualified: N; Green_EU RoHS: Passed; Green_EU RoHS-2: Passed
Q28-Q30 Q32-Q34 = CSD19536KTT: MOSFET, N-CH, 100 V, 200 A, KTT0002A (TO-263-2); Manufacturer: Texas Instruments; Alternate Manufacturer: None; U/M: EA; ChType: N; Value: 100V; VdsMax_V: 100; Value1: ? ohm; Value2: 118 nC; QgTyp_nC: 118; Vgs_V: 20; IdsMax_A: 200; SizeAreaWB_mm2: 198.208; SizeArea_mm2: 145.288; SizeX_mm: 14.3; SizeY_mm: 10.16; SizeZ_mm: 4.7; AEC Category: Q101; SymbolVersion: 2008-07-28; CompType: MOSFET; PartNumber: CSD19536KTT; PackageReference: KTT0002A; RoHS: Y; MountType: SMT; Published: 2008-06-19; Publisher: Texas Instruments; LatestRevisionDate: 2017-06-26; LatestRevisionNote: Added parts.; ComponentLink1Description: Datasheet link; ComponentLink1URL: http://www.ti.com/lit/ds/symlink/csd19536ktt.pdf; Supplier 1: Digi-Key; Supplier Part Number 1: 296-41136-1-ND; Supplier 2: Mouser; Supplier Part Number 2: 595-CSD19536KTT; AEC Qualified: ?
R116 = CRCW06032M49FKEA: RES, 2.49 M, 1%, 0.1 W, 0603; Manufacturer: Vishay-Dale; CompType: Resistor; Value: 2.49Meg; Res_ohm: 2490000; Value_Code: 2M49; Tolerance_%: 1; Power_W: 0.1; Value2: 0.1W; VDC_V: 75; TempCo: 100 ppm/C; SizeArea_mm2: 1.28; SizeX_mm: 1.6; SizeY_mm: 0.8; EIA_Code: E96; U/M: EA; AEC Category: Q200; SymbolVersion: 2009-05-29; PartNumber: CRCW06032M49FKEA; PackageReference: 0603; RoHS: Y; Value1: 1%; MountType: SMT; Technology: Thick Film; SizeZ_mm: 1; Published: 2008-06-26; Publisher: Texas Instruments; LatestRevisionDate: 2017-06-13; ComponentLink1Description: Datasheet link; ComponentLink1URL: http://www.vishay.com/docs/20035/dcrcwe3.pdf; Supplier 1: Digi-Key; Supplier Part Number 1: 541-2.49MHCT-ND; Supplier 2: Newark; Supplier Part Number 2: 52K8254; Supplier 3: Mouser; Supplier Part Number 3: 71-CRCW06032M49FKEA; AEC Qualified: ?
R117 R120 R124 R127 = CRCW0603100RFKEA: RES, 100, 1%, 0.1 W, 0603; Manufacturer: Vishay-Dale; CompType: Resistor; Value: 100; Value_Code: 100R; Tolerance_%: 1; Power_W: 0.1; Value2: 0.1W; VDC_V: 75; TempCo: 100 ppm/C; SizeArea_mm2: 1.28; SizeX_mm: 1.6; SizeY_mm: 0.8; EIA_Code: E96; U/M: EA; AEC Category: Q200; Green_Lifecycle: Active; Green_REACh: Passed; SymbolVersion: 2009-05-29; PartNumber: CRCW0603100RFKEA; PackageReference: 0603; RoHS: Y; Res_ohm: 100; Value1: 1%; MountType: SMT; Technology: Thick Film; SizeZ_mm: 1; Published: 2008-06-26; Publisher: Texas Instruments; LatestRevisionDate: 2017-06-13; ComponentLink1Description: Datasheet link; ComponentLink1URL: http://www.vishay.com/docs/20035/dcrcwe3.pdf; Supplier 1: Digi-Key; Supplier Part Number 1: 541-100HCT-ND; Supplier 2: Newark; Supplier Part Number 2: 52K8078; Supplier 3: Mouser; Supplier Part Number 3: 71-CRCW0603-100-E3; AEC Qualified: ?; Green_EU RoHS: Passed with Exemption; Green_EU RoHS-2: Passed
R118 R119 = CSNL2512FT2L00: RES, 0.002, 1%, 2 W, 2512; Manufacturer: Stackpole Electronics Inc; CompType: Resistor; Value: 0.002; Value_Code: 2L000; Tolerance_%: 1; Power_W: 2; Value2: 2W; VDC_V: 200; TempCo: 50 ppm/C; SizeArea_mm2: 20.16; SizeX_mm: 6.3; SizeY_mm: 3.2; SizeZ_mm: 0.71; U/M: EA; AEC Category: Q200; SymbolVersion: 2009-05-29; PartNumber: CSNL2512FT2L00; PackageReference: 2512; RoHS: Y; Res_ohm: 0.002; Value1: 1%; MountType: SMT; Technology: Metal Element; Published: 2008-06-26; Publisher: Texas Instruments; LatestRevisionDate: 2017-06-26; ComponentLink1Description: Datasheet link; ComponentLink1URL: http://www.seielect.com/catalog/SEI-CSNL.pdf; Supplier 1: Digi-Key; Supplier Part Number 1: CSNL2512FT2L00CT-ND; AEC Qualified: ?
R121 = CRCW060310M0JNEA: RES, 10 M, 5%, 0.1 W, 0603; Manufacturer: Vishay-Dale; CompType: Resistor; Value: 10Meg; Res_ohm: 10000000; Value_Code: 10M0; Tolerance_%: 5; Power_W: 0.1; Value2: 0.1W; VDC_V: 75; TempCo: 200 ppm/C; SizeArea_mm2: 1.28; SizeX_mm: 1.6; SizeY_mm: 0.8; SizeZ_mm: 1; EIA_Code: E24; U/M: EA; AEC Category: Q200; Green_Lifecycle: Active; Green_REACh: Passed; SymbolVersion: 2009-05-29; PartNumber: CRCW060310M0JNEA; PackageReference: 0603; RoHS: Y; Value1: 5%; MountType: SMT; Technology: Thick Film; Published: 2008-06-26; Publisher: Texas Instruments; LatestRevisionDate: 2017-06-13; ComponentLink1Description: Datasheet link; ComponentLink1URL: http://www.vishay.com/docs/20035/dcrcwe3.pdf; Supplier 1: Digi-Key; Supplier Part Number 1: 541-10MGCT-ND; Supplier 2: Newark; Supplier Part Number 2: 59M6761; Supplier 3: Mouser; Supplier Part Number 3: 71-CRCW0603J-10M-E3; AEC Qualified: ?; Green_EU RoHS: Passed with Exemption; Green_EU RoHS-2: Passed
R122 = CRCW06036M80JNEA: RES, 6.8 M, 5%, 0.1 W, 0603; Manufacturer: Vishay-Dale; CompType: Resistor; Value: 6.8Meg; Res_ohm: 6800000; Value_Code: 6M80; Tolerance_%: 5; Power_W: 0.1; Value2: 0.1W; VDC_V: 75; TempCo: 200 ppm/C; SizeArea_mm2: 1.28; SizeX_mm: 1.6; SizeY_mm: 0.8; SizeZ_mm: 1; EIA_Code: E24; U/M: EA; AEC Category: Q200; SymbolVersion: 2009-05-29; PartNumber: CRCW06036M80JNEA; PackageReference: 0603; RoHS: Y; Value1: 5%; MountType: SMT; Technology: Thick Film; Published: 2008-06-26; Publisher: Texas Instruments; LatestRevisionDate: 2017-06-13; ComponentLink1Description: Datasheet link; ComponentLink1URL: http://www.vishay.com/docs/20035/dcrcwe3.pdf; Supplier 1: Digi-Key; Supplier Part Number 1: 541-6.8MGCT-ND; Supplier 2: Mouser; Supplier Part Number 2: 71-CRCW0603J-6.8M-E3; AEC Qualified: ?
R123 = CRCW06033M00JNEA: RES, 3.0 M, 5%, 0.1 W, 0603; Manufacturer: Vishay-Dale; CompType: Resistor; Value: 3.0Meg; Res_ohm: 3000000; Value_Code: 3M00; Tolerance_%: 5; Power_W: 0.1; Value2: 0.1W; VDC_V: 75; TempCo: 200 ppm/C; SizeArea_mm2: 1.28; SizeX_mm: 1.6; SizeY_mm: 0.8; SizeZ_mm: 1; EIA_Code: E24; U/M: EA; AEC Category: Q200; Green_Lifecycle: Active; Green_REACh: Passed; SymbolVersion: 2009-05-29; PartNumber: CRCW06033M00JNEA; PackageReference: 0603; RoHS: Y; Value1: 5%; MountType: SMT; Technology: Thick Film; Published: 2008-06-26; Publisher: Texas Instruments; LatestRevisionDate: 2017-06-13; ComponentLink1Description: Datasheet link; ComponentLink1URL: http://www.vishay.com/docs/20035/dcrcwe3.pdf; Supplier 1: Digi-Key; Supplier Part Number 1: 541-3.0MGCT-ND; Supplier 2: Mouser; Supplier Part Number 2: 71-CRCW0603J-3M-E3; AEC Qualified: ?; Green_EU RoHS: Passed with Exemption; Green_EU RoHS-2: Passed
R125 = CRCW06031M00FKEA: RES, 1.00 M, 1%, 0.1 W, 0603; Manufacturer: Vishay-Dale; CompType: Resistor; Value: 1.00Meg; Res_ohm: 1000000; Value_Code: 1M00; Tolerance_%: 1; Power_W: 0.1; Value2: 0.1W; VDC_V: 75; TempCo: 100 ppm/C; SizeArea_mm2: 1.28; SizeX_mm: 1.6; SizeY_mm: 0.8; EIA_Code: E96; U/M: EA; AEC Category: Q200; Green_Lifecycle: Active; Green_REACh: Passed; SymbolVersion: 2009-05-29; PartNumber: CRCW06031M00FKEA; PackageReference: 0603; RoHS: Y; Value1: 1%; MountType: SMT; Technology: Thick Film; SizeZ_mm: 1; Published: 2008-06-26; Publisher: Texas Instruments; LatestRevisionDate: 2017-06-13; ComponentLink1Description: Datasheet link; ComponentLink1URL: http://www.vishay.com/docs/20035/dcrcwe3.pdf; Supplier 1: Digi-Key; Supplier Part Number 1: 541-1.00MHCT-ND; Supplier 2: Newark; Supplier Part Number 2: 52K8053; Supplier 3: Mouser; Supplier Part Number 3: 71-CRCW0603-1.0M-E3; AEC Qualified: ?; Green_EU RoHS: Passed with Exemption; Green_EU RoHS-2: Passed
R126 = CRCW0603115KFKEA: RES, 115 k, 1%, 0.1 W, 0603; Manufacturer: Vishay-Dale; CompType: Resistor; Value: 115k; Res_ohm: 115000; Tolerance_%: 1; Power_W: 0.1; Value2: 0.1W; VDC_V: 75; TempCo: 100 ppm/C; SizeArea_mm2: 1.28; SizeX_mm: 1.6; SizeY_mm: 0.8; EIA_Code: E96; U/M: EA; AEC Category: Q200; Green_Lifecycle: Active; Green_REACh: Passed; SymbolVersion: 2009-05-29; PartNumber: CRCW0603115KFKEA; PackageReference: 0603; RoHS: Y; Value_Code: 115k; Value1: 1%; MountType: SMT; Technology: Thick Film; SizeZ_mm: 1; Published: 2008-06-26; Publisher: Texas Instruments; LatestRevisionDate: 2017-06-13; ComponentLink1Description: Datasheet link; ComponentLink1URL: http://www.vishay.com/docs/20035/dcrcwe3.pdf; Supplier 1: Digi-Key; Supplier Part Number 1: 541-115KHCT-ND; Supplier 2: Newark; Supplier Part Number 2: 52K8099; Supplier 3: Mouser; Supplier Part Number 3: 71-CRCW0603-115K-E3; AEC Qualified: ?; Green_EU RoHS: Passed with Exemption; Green_EU RoHS-2: Passed
R128 = RC0603FR-07383KL: NC; Manufacturer: Yageo America; CompType: Resistor; Value: 383k; Res_ohm: 383000; Tolerance_%: 1; Value1: 1%; Power_W: 0.1; Value2: 0.1W; VDC_V: 150; TempCo: 200 ppm/C; SizeArea_mm2: 1.28; SizeX_mm: 1.6; SizeY_mm: 0.8; EIA_Code: E96; U/M: EA; AEC Category: Q200; SymbolVersion: 2009-05-29; PartNumber: RC0603FR-07383KL; ValueDisplayed: NC; PackageReference: 0603; RoHS: Y; Value_Code: 383k; MountType: SMT; Technology: Thick Film; SizeZ_mm: 1; Published: 2008-06-26; Publisher: Texas Instruments; LatestRevisionDate: 2017-06-13; ComponentLink1Description: Datasheet link; ComponentLink1URL: http://www.yageo.com/pdf/Pu-RC0603_51_PbFree_L_2.pdf; Supplier 1: Digi-Key; Supplier Part Number 1: 311-383KHRCT-ND; Supplier 2: Mouser; Supplier Part Number 2: 603-RC0603FR-07383KL; AEC Qualified: ?
R129 = RC0603FR-07383KL: RES, 383 k, 1%, 0.1 W, 0603; Manufacturer: Yageo America; CompType: Resistor; Value: 383k; Res_ohm: 383000; Tolerance_%: 1; Power_W: 0.1; Value2: 0.1W; VDC_V: 150; TempCo: 200 ppm/C; SizeArea_mm2: 1.28; SizeX_mm: 1.6; SizeY_mm: 0.8; EIA_Code: E96; U/M: EA; AEC Category: Q200; SymbolVersion: 2009-05-29; PartNumber: RC0603FR-07383KL; PackageReference: 0603; RoHS: Y; Value_Code: 383k; Value1: 1%; MountType: SMT; Technology: Thick Film; SizeZ_mm: 1; Published: 2008-06-26; Publisher: Texas Instruments; LatestRevisionDate: 2017-06-13; ComponentLink1Description: Datasheet link; ComponentLink1URL: http://www.yageo.com/pdf/Pu-RC0603_51_PbFree_L_2.pdf; Supplier 1: Digi-Key; Supplier Part Number 1: 311-383KHRCT-ND; Supplier 2: Mouser; Supplier Part Number 2: 603-RC0603FR-07383KL; AEC Qualified: ?
R130 = CRCW0603240KJNEA: RES, 240 k, 5%, 0.1 W, 0603; Manufacturer: Vishay-Dale; CompType: Resistor; Value: 240k; Res_ohm: 240000; Tolerance_%: 5; Power_W: 0.1; Value2: 0.1W; VDC_V: 75; TempCo: 200 ppm/C; SizeArea_mm2: 1.28; SizeX_mm: 1.6; SizeY_mm: 0.8; SizeZ_mm: 1; EIA_Code: E24; U/M: EA; AEC Category: Q200; Green_Lifecycle: Active; Green_REACh: Passed; SymbolVersion: 2009-05-29; PartNumber: CRCW0603240KJNEA; PackageReference: 0603; RoHS: Y; Value_Code: 240k; Value1: 5%; MountType: SMT; Technology: Thick Film; Published: 2008-06-26; Publisher: Texas Instruments; LatestRevisionDate: 2017-06-13; ComponentLink1Description: Datasheet link; ComponentLink1URL: http://www.vishay.com/docs/20035/dcrcwe3.pdf; Supplier 1: Digi-Key; Supplier Part Number 1: 541-240KGCT-ND; AEC Qualified: ?; Green_EU RoHS: Passed with Exemption; Green_EU RoHS-2: Passed
R131 = CRCW0603715KFKEA: RES, 715 k, 1%, 0.1 W, 0603; Manufacturer: Vishay-Dale; CompType: Resistor; Value: 715k; Res_ohm: 715000; Tolerance_%: 1; Power_W: 0.1; Value2: 0.1W; VDC_V: 75; TempCo: 100 ppm/C; SizeArea_mm2: 1.28; SizeX_mm: 1.6; SizeY_mm: 0.8; EIA_Code: E96; U/M: EA; AEC Category: Q200; SymbolVersion: 2009-05-29; PartNumber: CRCW0603715KFKEA; PackageReference: 0603; RoHS: Y; Value_Code: 715k; Value1: 1%; MountType: SMT; Technology: Thick Film; SizeZ_mm: 1; Published: 2008-06-26; Publisher: Texas Instruments; LatestRevisionDate: 2017-06-13; ComponentLink1Description: Datasheet link; ComponentLink1URL: http://www.vishay.com/docs/20035/dcrcwe3.pdf; Supplier 1: Digi-Key; Supplier Part Number 1: 541-715KHCT-ND; Supplier 2: Newark; Supplier Part Number 2: 52K8701; Supplier 3: Mouser; Supplier Part Number 3: 71-CRCW0603-715K-E3; AEC Qualified: ?
R132 R133 = CRCW2512604RFKEG: RES, 604, 1%, 1 W, AEC-Q200 Grade 0, 2512; Manufacturer: Vishay-Dale; CompType: Resistor; Value: 604; Value_Code: 604R; Tolerance_%: 1; Value2: 1W; VDC_V: 500; TempCo: 100 ppm/C; SizeArea_mm2: 20.16; SizeX_mm: 6.3; SizeY_mm: 3.2; SizeZ_mm: 0.71; EIA_Code: E96; U/M: EA; AEC Category: Q200; AEC Qualified: Y; AEC Grade: 0; SymbolVersion: 2009-05-29; PartNumber: CRCW2512604RFKEG; PackageReference: 2512; RoHS: Y; Res_ohm: 604; Value1: 1%; Power_W: 1; MountType: SMT; Technology: Thick Film; Published: 2008-06-26; Publisher: Texas Instruments; LatestRevisionDate: 2017-06-26; ComponentLink1Description: Datasheet link; ComponentLink1URL: http://www.vishay.com/doc?20035; Supplier 1: Digi-Key; Supplier Part Number 1: 541-604AFCT-ND
U15 = CMP-0080798-1: 100-V Low IQ Synchronous Buck Regulator, DDA0008E (SOIC-8); Alternate Manufacturer: Texas Instruments; SizeAreaWB_mm2: 57.4; SizeZ_mm: 1.7; SizeX_mm: 5; SizeY_mm: 6.2; SizeArea_mm2: 31; CompType: IC; AEC Qualified: N; AEC Category: Q200; ComponentLink1URL: http://www.ti.com/lit/ds/symlink/lm5164.pdf; PackageDescription: SOIC-8; MountType: SMT; ComponentLink2URL: http://www.ti.com/product/lm5164; ComponentLink3Description: Online Datasheet; ComponentLink2Description: Product Folder; Manufacturer: Texas Instruments; ComponentLink3URL: http://www.ti.com/product/lm5164/datasheet; PackageReference: DDA0008E; PartNumber: LM5164DDAT; ComponentLink1Description: Datasheet Link